# EAGLE design StepperBoard (EAGLE 4.16)
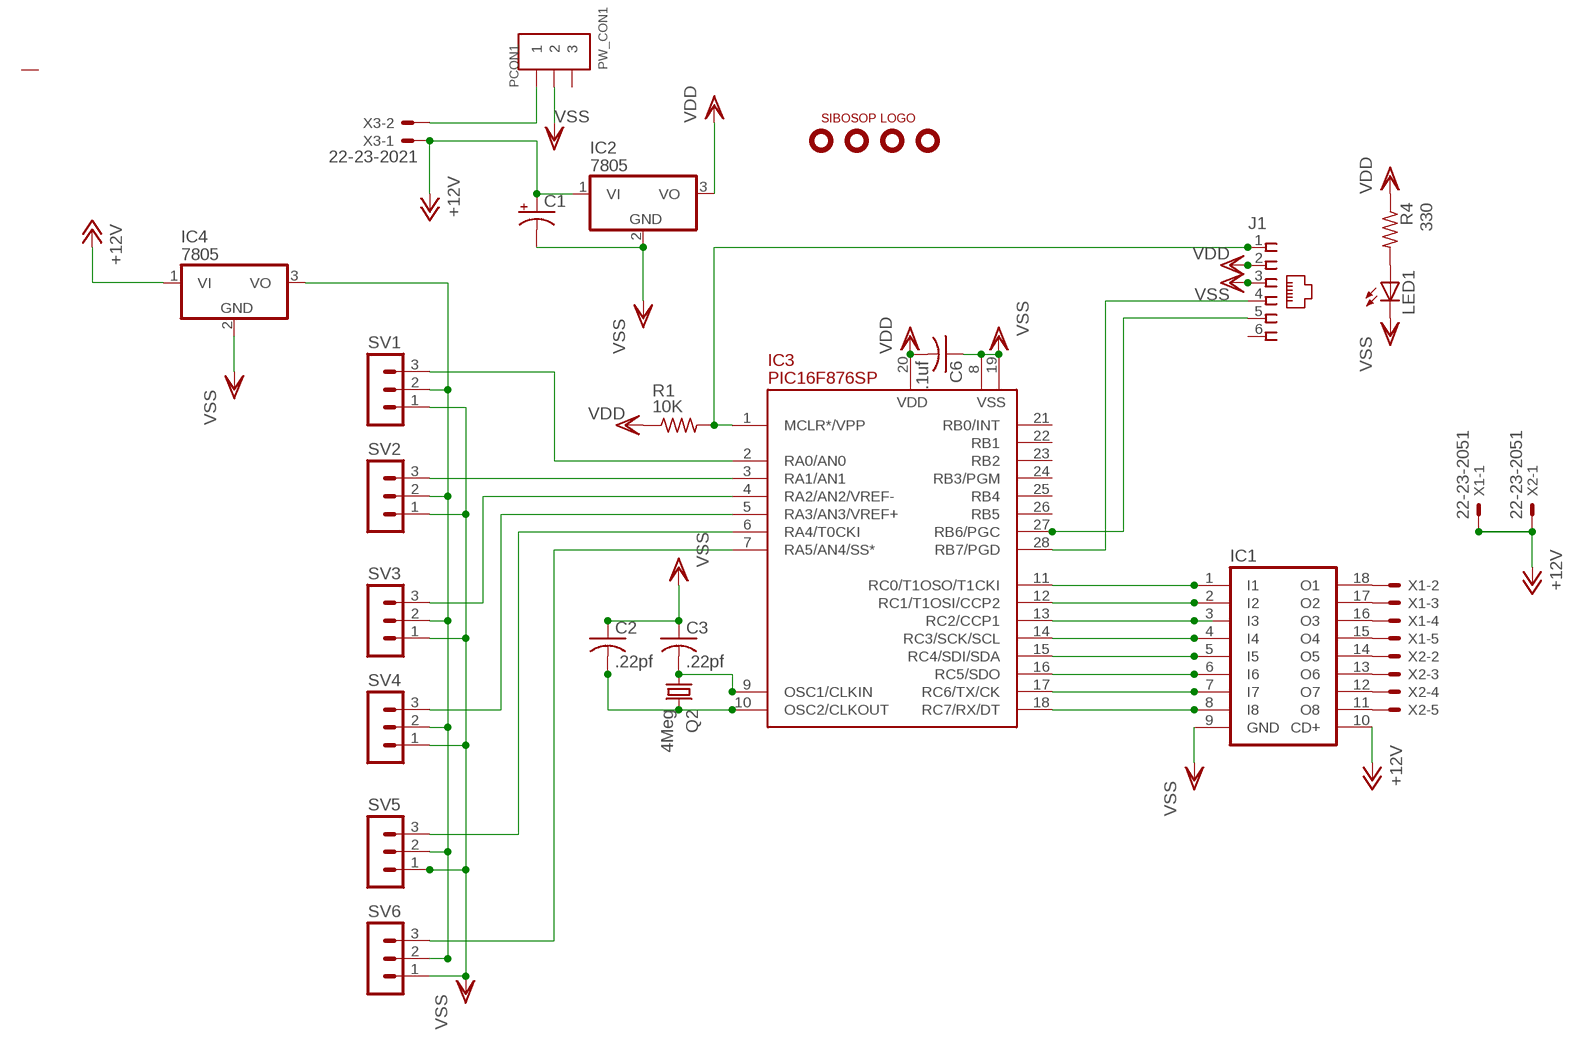
[diagram p0: schematic, sheet 1]

## Parts
C1  CPOL-USE3.5-10  [E3,5-10]
C2  .22pf  C-US025-024X044  [C025-024X044]
C3  .22pf  C-US025-024X044  [C025-024X044]
C6  .1uf  C-US025-024X044  [C025-024X044]
IC1  ULN2803A  [DIL18]
IC2  7805  [TO220V]
IC3  PIC16F876SP  [DIL28-3]
IC4  7805  [TO220V]
J1  520250-3  [520250-3]
LED1  LEDSQR2X5  [LED2X5]
PCON1  PW_CON1  [PW_CON1]
Q2  4Meg  CRYSTALHC49S  [HC49/S]
R1  10K  R-US_0204/2V  [0204V]
R4  330  R-US_0204/2V  [0204V]
SV1  MA03-1  [MA03-1]
SV2  MA03-1  [MA03-1]
SV3  MA03-1  [MA03-1]
SV4  MA03-1  [MA03-1]
SV5  MA03-1  [MA03-1]
SV6  MA03-1  [MA03-1]
U$1  HOLE-125  [HOLE-125]
U$2  HOLE-125  [HOLE-125]
U$3  LOGO  [LOGO]
U$5  HOLE-125  [HOLE-125]
U$7  HOLE-125  [HOLE-125]
X1  22-23-2051  [22-23-2051]
X2  22-23-2051  [22-23-2051]
X3  22-23-2021  [22-23-2021]

## Nets
+12V: C1.+ IC1.10(CD+) IC2.1(VI) IC4.1(VI) X1.1 X2.1 X3.1
N$1: IC3.1(MCLR*/VPP) J1.1 R1.2
N$2: IC4.3(VO) SV1.2 SV2.2 SV3.2 SV4.2 SV5.2 SV6.2
N$3: C2.2 IC3.10(OSC2/CLKOUT) Q2.2
N$4: C3.2 IC3.9(OSC1/CLKIN) Q2.1
N$5: IC1.1(I1) IC3.11(RC0/T1OSO/T1CKI)
N$6: IC1.2(I2) IC3.12(RC1/T1OSI/CCP2)
N$7: IC1.3(I3) IC3.13(RC2/CCP1)
N$8: IC1.4(I4) IC3.14(RC3/SCK/SCL)
N$9: IC1.5(I5) IC3.15(RC4/SDI/SDA)
N$10: IC1.6(I6) IC3.16(RC5/SDO)
N$11: IC1.7(I7) IC3.17(RC6/TX/CK)
N$12: IC1.8(I8) IC3.18(RC7/RX/DT)
N$13: IC1.18(O1) X1.2
N$14: IC3.27(RB6/PGC) J1.5
N$15: IC1.17(O2) X1.3
N$16: IC1.16(O3) X1.4
N$17: IC1.15(O4) X1.5
N$18: IC1.14(O5) X2.2
N$19: IC1.13(O6) X2.3
N$20: IC1.12(O7) X2.4
N$21: IC3.28(RB7/PGD) J1.4
N$22: LED1.A R4.2
N$23: IC1.11(O8) X2.5
N$25: IC3.2(RA0/AN0) SV1.3
N$26: IC3.3(RA1/AN1) SV2.3
N$27: IC3.4(RA2/AN2/VREF-) SV3.3
N$28: IC3.5(RA3/AN3/VREF+) SV4.3
N$29: IC3.6(RA4/T0CKI) SV5.3
N$30: IC3.7(RA5/AN4/SS*) SV6.3
N$31: PCON1.P$1 X3.2
VDD: C6.2 IC2.3(VO) IC3.20(VDD) J1.2 R1.1 R4.1
VSS: C1.- C2.1 C3.1 C6.1 IC1.9(GND) IC2.2(GND) IC3.8(VSS) IC3.19(VSS) IC4.2(GND) J1.3 LED1.K(C) PCON1.P$2 SV1.1 SV2.1 SV3.1 SV4.1 SV5.1 SV6.1
Unconnected: IC3.21(RB0/INT) IC3.22(RB1) IC3.23(RB2) IC3.24(RB3/PGM) IC3.25(RB4) IC3.26(RB5) J1.6 PCON1.P$3

## Library data of the parts
C1 = rcl:CPOL-US: POLARIZED CAPACITOR, American symbol
C2 C3 C6 = rcl:C-US: CAPACITOR, American symbol
IC1 = uln-udn:ULN2803A: DRIVER ARRAY
IC2 IC4 = kmarx1:78*: 78xx Family - Positive voltage regulator
IC3 = pic16f87x:PIC16F876: FLASH MICROCONTROLLER
J1 = con-amp:520250-3: AMP connector
LED1 = led:LED: LED OSRAM: - CHIPLED LG R971, LG N971, LY N971, LG Q971, LY Q971, LO R971, LY R971 LH N974, LH R974 LS Q976, LO Q976, LY Q976 LO Q996 - Hyper CHIPLED LW Q18S LB Q993, LB Q99A, LB R99A - SideLED LS A670, LO A670, LY A670, LG A670, LP A670 LB A673, LV A673, LT A673, LW A673 LH A674 LY A675 LS A676, LA A676, LO A676, LY A676, LW A676 LS A679, LY A679, LG A679 - Hyper Micro SIDELED® LS Y876, LA Y876, LO Y876, LY Y876 LT Y87S - SmartLED LW L88C, LW L88S LB L89C, LB L89S, LG L890 LS L89K, LO L89K, LY L89K LS L896, LA L896, LO L896, LY L896 - TOPLED LS T670, LO T670, LY T670, LG T670, LP T670 LSG T670, LSP T670, LSY T670, LOP T670, LYG T670 LG T671, LOG T671, LSG T671 LB T673, LV T673, LT T673, LW T673 LH T674 LS T676, LA T676, LO T676, LY T676, LB T676, LH T676, LSB T676, LW T676 LB T67C, LV T67C, LT T67C, LS T67K, LO T67K, LY T67K, LW E67C LS E67B, LA E67B, LO E67B, LY E67B, LB E67C, LV E67C, LT E67C LW T67C LS T679, LY T679, LG T679 LS T770, LO T770, LY T770, LG T770, LP T770 LB T773, LV T773, LT T773, LW T773 LH T774 LS E675, LA E675, LY E675, LS T675 LS T776, LA T776, LO T776, LY T776, LB T776 LHGB T686 LT T68C, LB T68C - Hyper Mini TOPLED® LB M676 - Mini TOPLED Santana® LG M470 LS M47K, LO M47K, LY M47K Source: http://www.osram.convergy.de - LUMILED® LXK2-PW12-R00, LXK2-PW12-S00, LXK2-PW14-U00, LXK2-PW14-V00 LXK2-PM12-R00, LXK2-PM12-S00, LXK2-PM14-U00 LXK2-PE12-Q00, LXK2-PE12-R00, LXK2-PE12-S00, LXK2-PE14-T00, LXK2-PE14-U00 LXK2-PB12-K00, LXK2-PB12-L00, LXK2-PB12-M00, LXK2-PB14-N00, LXK2-PB14-P00, LXK2-PB14-Q00 LXK2-PR12-L00, LXK2-PR12-M00, LXK2-PR14-Q00, LXK2-PR14-R00 LXK2-PD12-Q00, LXK2-PD12-R00, LXK2-PD12-S00 LXK2-PH12-R00, LXK2-PH12-S00 LXK2-PL12-P00, LXK2-PL12-Q00, LXK2-PL12-R00 Source: www.luxeon.com
PCON1 = powerconnectorskt:PW_CON1
Q2 = crystal:CRYSTAL: CRYSTAL
R1 R4 = rcl:R-US_: RESISTOR, American symbol
SV1-SV6 = con-lstb:MA03-1: PIN HEADER
U$1 U$2 U$5 U$7 = sibosop:HOLE-125
U$3 = sibosop:LOGO
X1 X2 = con-molex:22-23-2051: .100" (2.54mm) Center Header - 5 Pin
X3 = con-molex:22-23-2021: .100" (2.54mm) Center Header - 2 Pin

## Board
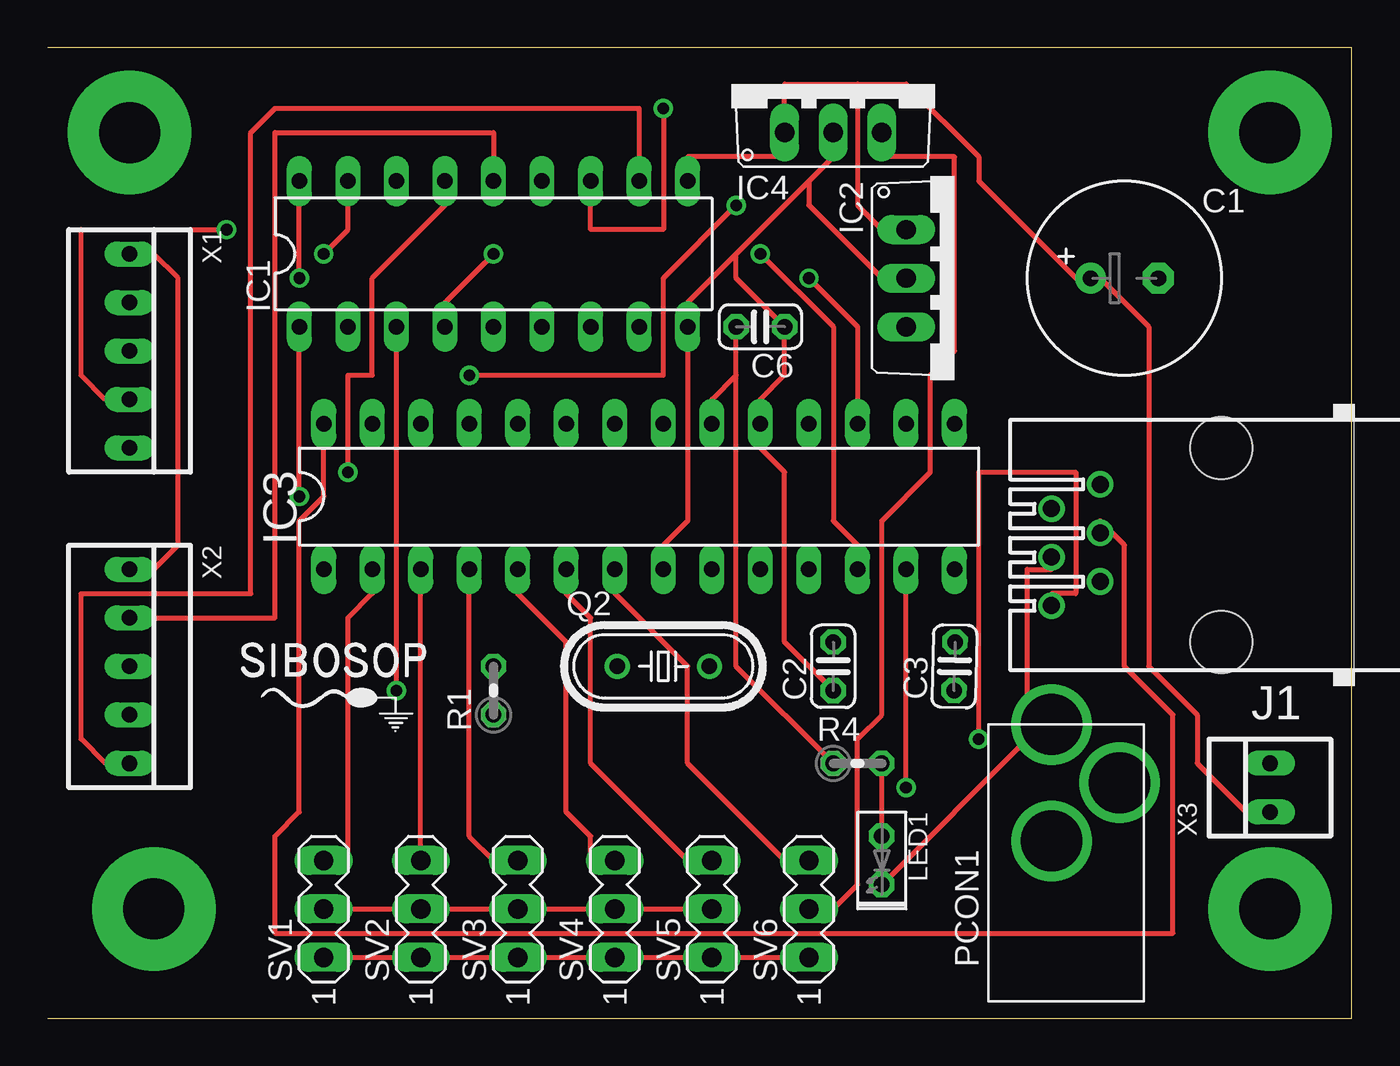
[diagram p1: board, top side]
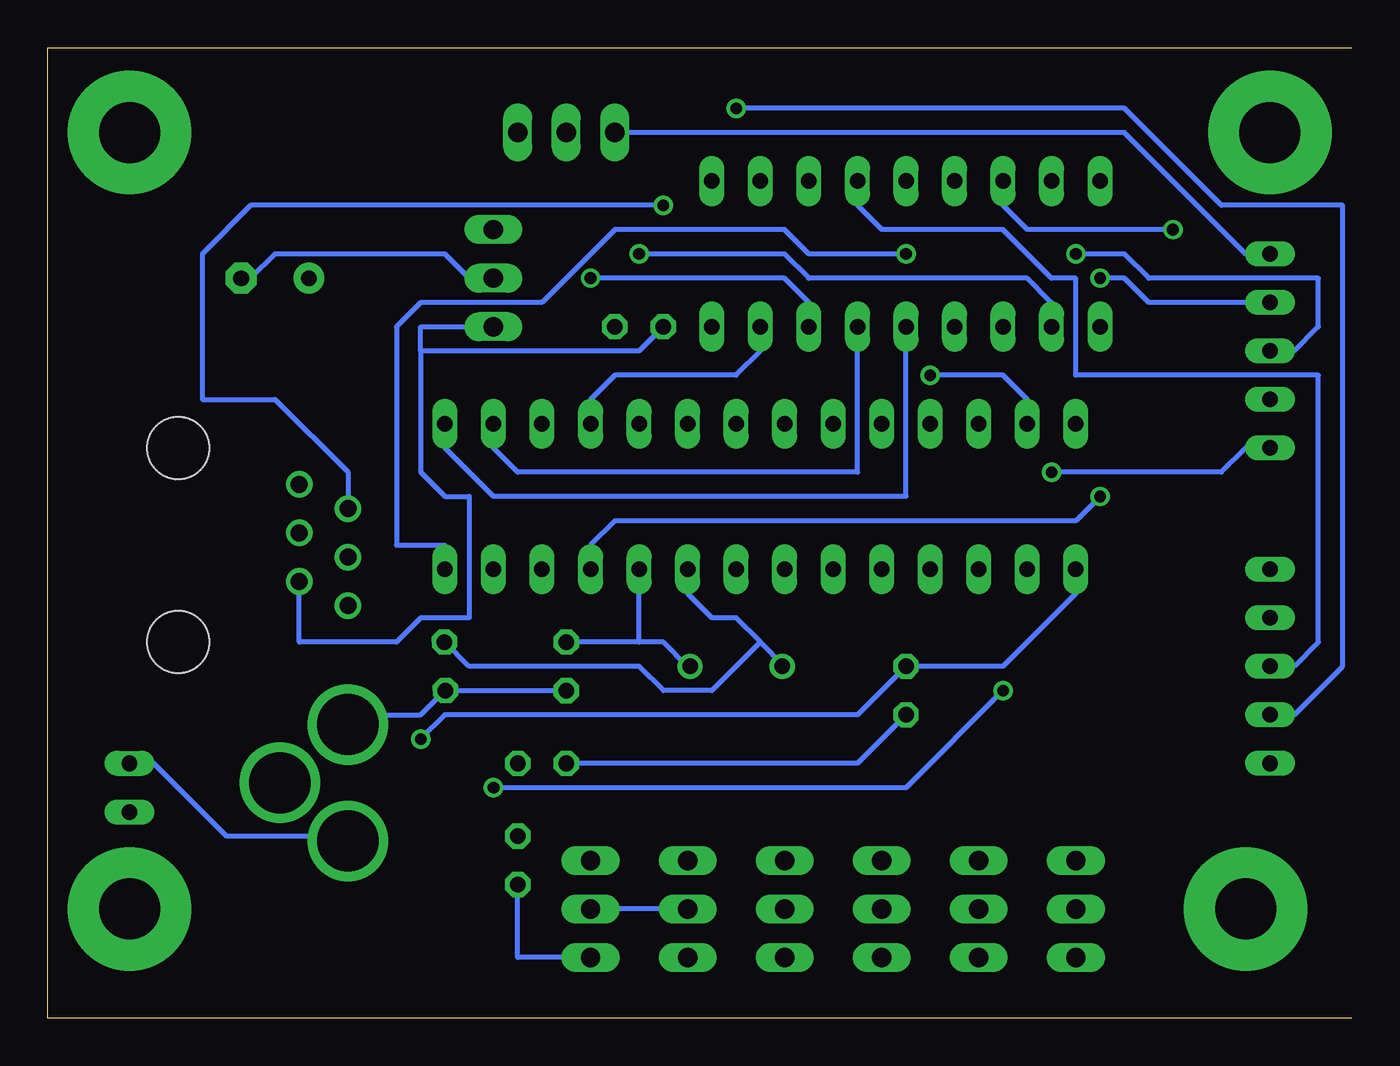
[diagram p2: board, bottom side, seen from below]

Size 68.25 x 50.79 mm. Coordinates in mm from the lower left corner, seen from the top.
Outline: 0,0 68.25,0 68.25,50.79 0,50.79
Copper layers (1*16): Top 0.035mm / dielectric 1.5mm / Bottom 0.035mm
Design rules "default": minimum track width 10mil, minimum drill 24mil, track to track 8mil, track to pad 8mil, pad to pad 8mil, via to via 8mil, smd to smd 8mil, copper to edge 40mil, drill to drill 8mil, minimum pad ring 10mil, minimum via ring 8mil, stop-mask expansion 4mil, vias tented up to drill 0mil, thermal gap 10mil

### Footprints (pad centres in the part's own frame; a part is rotated, then mirrored left to right if it is on the bottom)
E3,5-10 = drill 0.813 pad 1.6 round: + -1.778,0 | drill 0.813 pad 1.6 octagon: - 1.778,0
C025-024X044 = drill 0.813 octagon: 1 -1.27,0; 2 1.27,0
DIL18 = drill 0.813 long: 1 -10.16,-3.81; 2 -7.62,-3.81; 3 -5.08,-3.81; 4 -2.54,-3.81; 5 0,-3.81; 6 2.54,-3.81; 7 5.08,-3.81; 8 7.62,-3.81; 9 10.16,-3.81; 10 10.16,3.81; 11 7.62,3.81; 12 5.08,3.81; 13 2.54,3.81; 14 0,3.81; 15 -2.54,3.81; 16 -5.08,3.81; 17 -7.62,3.81; 18 -10.16,3.81
TO220V = drill 1.016 long: 1 -2.54,0; 2 0,0; 3 2.54,0
DIL28-3 = drill 0.813 long: 1 -16.51,-3.81; 2 -13.97,-3.81; 3 -11.43,-3.81; 4 -8.89,-3.81; 5 -6.35,-3.81; 6 -3.81,-3.81; 7 -1.27,-3.81; 8 1.27,-3.81; 9 3.81,-3.81; 10 6.35,-3.81; 11 8.89,-3.81; 12 11.43,-3.81; 13 13.97,-3.81; 14 16.51,-3.81; 15 16.51,3.81; 16 13.97,3.81; 17 11.43,3.81; 18 8.89,3.81; 19 6.35,3.81; 20 3.81,3.81; 21 1.27,3.81; 22 -1.27,3.81; 23 -3.81,3.81; 24 -6.35,3.81; 25 -8.89,3.81; 26 -11.43,3.81; 27 -13.97,3.81; 28 -16.51,3.81
520250-3 = drill 0.889 round: 1 -3.175,8.89; 2 -1.905,6.35; 3 -0.635,8.89; 4 0.635,6.35; 5 1.905,8.89; 6 3.175,6.35 | hole 3.251: -5.08,0; 5.08,0
LED2X5 = drill 0.813 octagon: A -1.27,0; K 1.27,0
PW_CON1 = drill 3.2 pad 3.81 round: P$1 -0.254,0; P$2 5.842,0; P$3 2.794,-3.556
HC49/S = drill 0.813 round: 1 -2.413,0; 2 2.413,0
0204V = drill 0.813 octagon: 1 -1.27,0; 2 1.27,0
MA03-1 = drill 1.016 long: 1 -2.54,0; 2 0,0; 3 2.54,0
HOLE-125 = drill 3.2 pad 6.452 round: P$1 0,0
22-23-2051 = drill 0.813 long: 1 -5.08,0; 2 -2.54,0; 3 0,0; 4 2.54,0; 5 5.08,0
22-23-2021 = drill 0.813 long: 1 -1.27,0; 2 1.27,0

### Placement (x,y rotation side)
C1  56.35,38.73 0 top
C2  41.11,18.41 90 top
C3  47.46,18.41 88.6 top
C6  37.3,36.19 180 top
IC1  23.33,40 0 top
IC2  44.92,38.73 270 top
IC3  30.95,27.3 0 top
IC4  41.11,46.35 0 top
J1  61.43,24.76 90 top
LED1  43.65,8.25 270 top
PCON1  52.54,9.52 90 top
Q2  32.22,18.41 0 top
R1  23.33,17.14 90 top
R4  42.38,13.33 0 top
SV1  14.44,5.71 90 top
SV2  19.52,5.71 90 top
SV3  24.6,5.71 90 top
SV4  29.68,5.71 90 top
SV5  34.76,5.71 90 top
SV6  39.84,5.71 90 top
U$1  63.97,46.35 0 top
U$2  4.28,46.35 0 top
U$3  14.44,18.41 0 top
U$5  5.55,5.71 0 top
U$7  63.97,5.71 0 top
X1  4.28,34.92 270 top
X2  4.28,18.41 270 top
X3  63.97,12.06 90 top

### Tracks (layer width: path | path; a pad name or v marks a point on that pad's centre or on a via)
+12V
  Top 0.254: X3.1 62.7,10.79 60.16,13.33 60.16,15.87 57.62,18.41 57.62,36.19 55.08,38.73 C1.+ 53.81,38.73 48.73,43.81 48.73,45.08 44.92,48.89 42.38,48.89 | X2.1 5.55,23.49 6.82,24.76 6.82,38.73 5.55,40 X1.1 | IC1.10 33.49,45.08 38.57,45.08 IC4.1 38.57,48.89 42.38,48.89 | 42.38,48.89 42.38,42.54 43.65,41.27 IC2.1
  Bottom 0.254: IC4.1 11.9,46.35 5.55,40 X1.1
N$1  (via drill 0.61)
  Top 0.254: v48.73,14.6 48.73,28.57 53.81,28.57 53.81,22.22 52.54,22.22 J1.1
  Bottom 0.254: IC3.1 14.44,22.22 18.25,18.41 R1.2 25.87,15.87 47.46,15.87 v48.73,14.6
N$2
  Top 0.254: SV1.2 SV2.2 SV3.2 SV4.2 SV5.2 | IC4.3 43.65,45.08 47.46,45.08 47.46,34.92 46.19,33.65 46.19,28.57 43.65,26.03 43.65,15.87 42.38,14.6 42.38,6.98 41.11,5.71 SV6.2
  Bottom 0.254: SV5.2 SV6.2
N$3
  Bottom 0.254: 37.3,19.68 C2.2 | 37.3,19.68 36.03,19.68 34.76,18.41 Q2.2 | 37.3,19.68 IC3.10
N$4
  Bottom 0.254: 30.95,19.68 32.22,20.95 33.49,20.95 34.76,22.22 IC3.9 | 30.95,19.68 29.68,18.41 Q2.1 | 30.95,19.68 33.49,17.14 36.03,17.14 37.3,18.41 46.19,18.41 47.46,19.68 C3.2
N$5  (via drill 0.61)
  Top 0.254: v13.17,27.3 IC1.1
  Bottom 0.254: v13.17,27.3 14.44,26.03 38.57,26.03 39.84,24.76 IC3.11
N$6  (via drill 0.61)
  Top 0.254: v37.3,40 41.11,36.19 41.11,26.03 42.38,24.76 IC3.12
  Bottom 0.254: v37.3,40 29.68,40 28.41,38.73 16.98,38.73 15.71,37.46 IC1.2
N$7  (via drill 0.61)
  Top 0.254: v18.25,17.14 IC1.3 | v44.92,12.06 IC3.13
  Bottom 0.254: v18.25,17.14 23.33,12.06 v44.92,12.06
N$8  (via drill 0.61)
  Top 0.254: v23.33,40 20.79,37.46 IC1.4
  Bottom 0.254: v23.33,40 28.41,40 29.68,41.27 38.57,41.27 42.38,37.46 48.73,37.46 50,36.19 50,24.76 47.46,24.76 IC3.14
N$9
  Bottom 0.254: IC1.5 23.33,27.3 44.92,27.3 47.46,29.84 IC3.15
N$10
  Bottom 0.254: IC1.6 25.87,28.57 43.65,28.57 44.92,29.84 IC3.16
N$11  (via drill 0.61)
  Top 0.254: v39.84,38.73 42.38,36.19 IC3.17
  Bottom 0.254: v39.84,38.73 29.68,38.73 28.41,37.46 IC1.7
N$12
  Bottom 0.254: IC1.8 30.95,34.92 32.22,33.65 38.57,33.65 39.84,32.38 IC3.18
N$13  (via drill 0.61)
  Top 0.254: v13.17,38.73 IC1.18
  Bottom 0.254: v13.17,38.73 11.9,38.73 10.63,37.46 X1.2
N$14  (via drill 0.61)
  Top 0.254: v22.06,33.65 32.22,33.65 32.22,38.73 v36.03,42.54
  Bottom 0.254: v22.06,33.65 18.25,33.65 16.98,32.38 IC3.27 | v36.03,42.54 57.62,42.54 60.16,40 60.16,32.38 56.35,32.38 52.54,28.57 J1.5
N$15  (via drill 0.61)
  Top 0.254: v14.44,40 15.71,41.27 IC1.17
  Bottom 0.254: v14.44,40 11.9,40 10.63,38.73 1.74,38.73 1.74,36.19 3.01,34.92 X1.3
N$16  (via drill 0.61)
  Top 0.254: v9.36,41.27 1.74,41.27 1.74,33.65 3.01,32.38 X1.4
  Bottom 0.254: v9.36,41.27 16.98,41.27 18.25,42.54 IC1.16
N$17  (via drill 0.61)
  Top 0.254: v15.71,28.57 15.71,33.65 16.98,33.65 16.98,38.73 20.79,42.54 IC1.15
  Bottom 0.254: v15.71,28.57 6.82,28.57 5.55,29.84 X1.5
N$18
  Top 0.254: X2.2 11.9,20.95 11.9,46.35 23.33,46.35 IC1.14
N$19
  Bottom 0.254: X2.3 3.01,18.41 1.74,19.68 1.74,33.65 14.44,33.65 14.44,38.73 15.71,38.73 18.25,41.27 24.6,41.27 25.87,42.54 IC1.13
N$20  (via drill 0.61)
  Top 0.254: v32.22,47.62 32.22,41.27 28.41,41.27 IC1.12
  Bottom 0.254: v32.22,47.62 11.9,47.62 6.82,42.54 0.47,42.54 0.47,18.41 3.01,15.87 X2.4
N$21
  Top 0.254: IC3.28 14.44,27.3 13.17,26.03 13.17,10.79 11.9,9.52 11.9,4.44 58.89,4.44 58.89,15.87 56.35,18.41 56.35,24.76 55.08,26.03 J1.4
N$22
  Top 0.254: LED1.A R4.2
N$23
  Top 0.254: X2.5 3.01,13.33 1.74,14.6 1.74,22.22 10.63,22.22 10.63,46.35 11.9,47.62 30.95,47.62 IC1.11
N$25
  Top 0.254: IC3.2 16.98,22.22 15.71,20.95 15.71,8.25 SV1.3
N$26
  Top 0.254: SV2.3 IC3.3
N$27
  Top 0.254: IC3.4 22.06,9.52 23.33,8.25 SV3.3
N$28
  Top 0.254: IC3.5 24.6,22.22 27.14,19.68 27.14,10.79 28.41,9.52 28.41,8.25 SV4.3
N$29
  Top 0.254: IC3.6 27.14,22.22 28.41,20.95 28.41,13.33 33.49,8.25 SV5.3
N$30
  Top 0.254: IC3.7 29.68,22.22 33.49,18.41 33.49,13.33 38.57,8.25 SV6.3
N$31
  Bottom 0.254: X3.2 62.7,13.33 58.89,9.52 53.81,9.52 PCON1.P$1
VDD
  Top 0.254: 36.03,33.65 34.76,32.38 IC3.20 | 36.03,33.65 C6.2 | R4.1 36.03,18.41 36.03,33.65
  Bottom 0.254: R1.1 25.87,13.33 R4.1 | 48.73,34.92 48.73,36.19 IC2.3 | 48.73,34.92 48.73,28.57 47.46,27.3 46.19,27.3 46.19,20.95 48.73,20.95 50,19.68 55.08,19.68 J1.2 | C6.2 37.3,34.92 48.73,34.92
VSS
  Top 0.254: IC3.8 32.22,24.76 33.49,26.03 IC1.9 33.49,37.46 36.03,40 | 36.03,40 39.84,43.81 | 39.84,43.81 41.11,45.08 IC4.2 | 39.84,43.81 39.84,42.54 43.65,38.73 IC2.2 | 36.03,40 36.03,38.73 C6.1 38.57,33.65 37.3,32.38 IC3.19 37.3,29.84 38.57,28.57 38.57,19.68 C2.1 | J1.3 52.54,23.49 51.27,23.49 51.27,15.87 PCON1.P$2 51.27,14.6 LED1.K | SV6.1 SV5.1 SV4.1 SV3.1 SV2.1 SV1.1
  Bottom 0.254: C1.- 57.62,38.73 56.35,40 47.46,40 46.19,38.73 IC2.2 | 47.46,17.14 C2.1 | 47.46,17.14 48.73,15.87 51.27,15.87 PCON1.P$2 | 47.46,17.14 C3.1 | LED1.K 43.65,3.17 SV6.1

### Text on the board
tValues: 09-16-2007